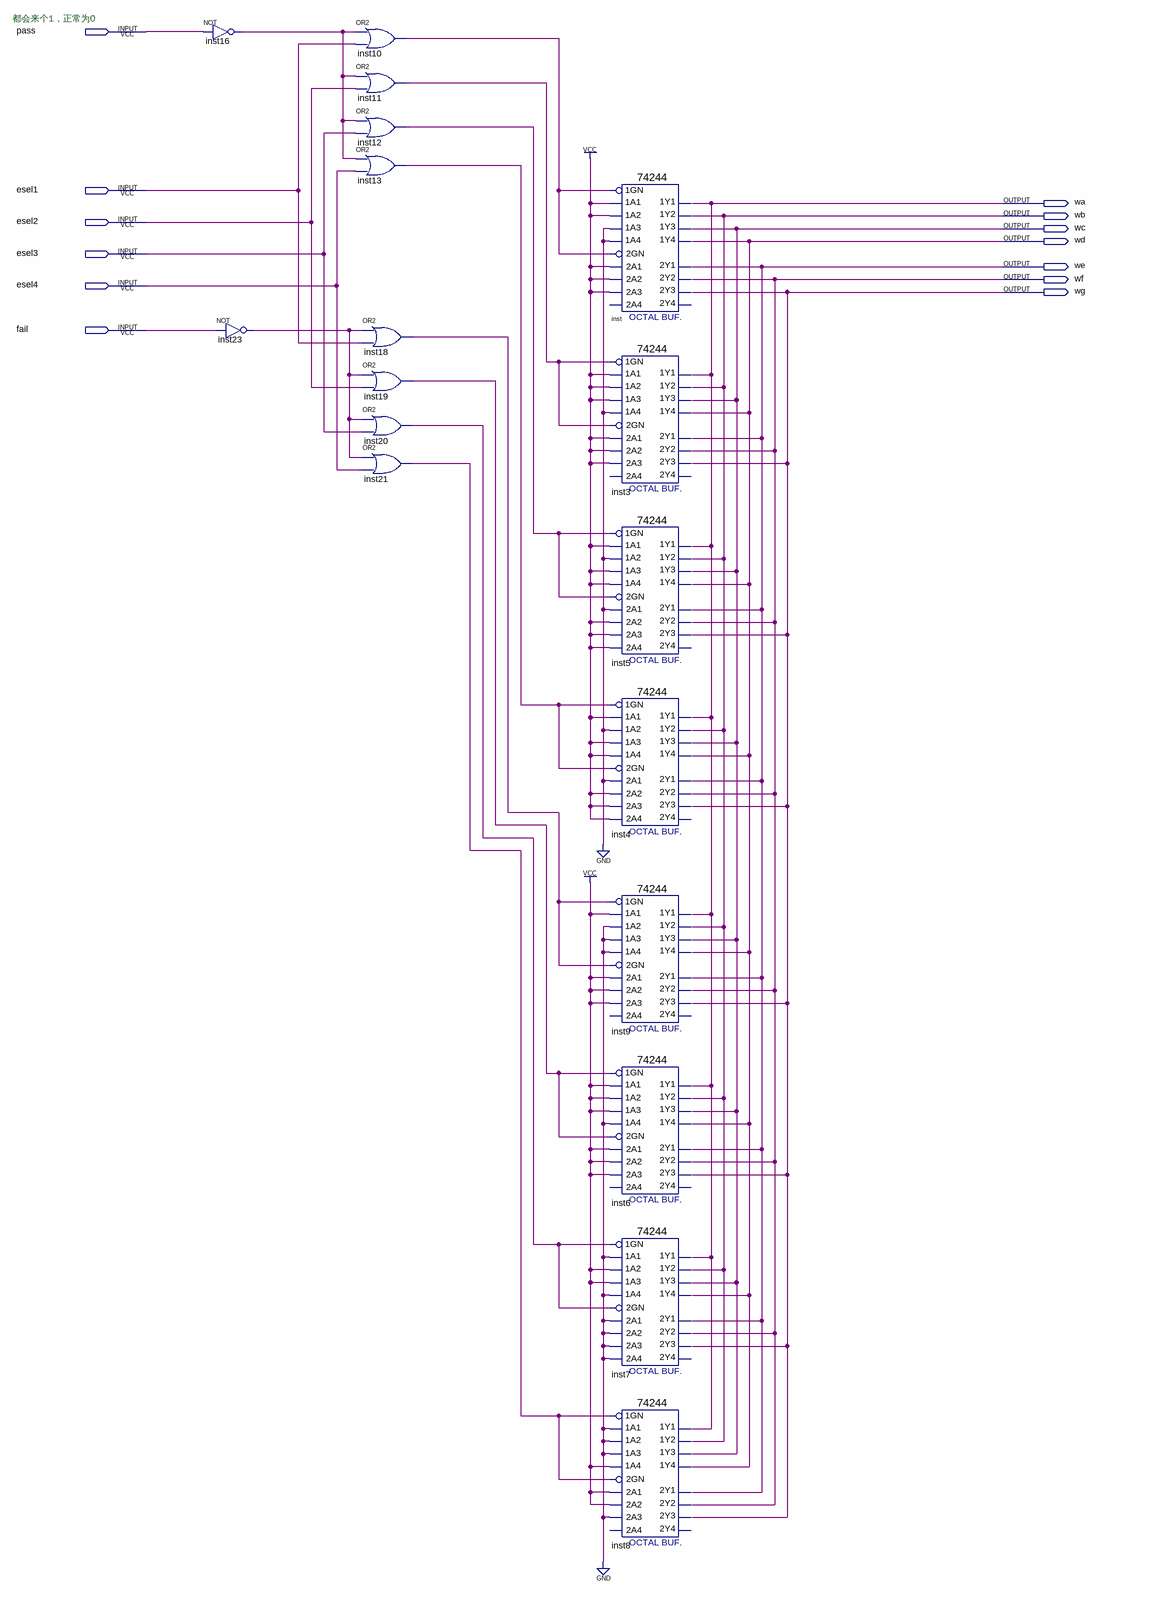
[diagram p0: schematic sheet]
// Quartus schematic wr_pa.bdf as structural Verilog: 18 symbols, 13 pins
module wr_pa (
  input  pass,
  input  esel1,
  input  esel2,
  input  esel3,
  input  esel4,
  input  fail,
  output wa,
  output wb,
  output wc,
  output wd,
  output we,
  output wf,
  output wg
);

  wire inst10_out, inst11_out, inst12_out, inst13_out, inst16_out, inst18_out, inst19_out, inst20_out,
       inst21_out, inst23_out;

  not inst16 (inst16_out, pass);
  not inst23 (inst23_out, fail);
  or inst10 (inst10_out, inst16_out, esel1);
  or inst11 (inst11_out, inst16_out, esel2);
  or inst12 (inst12_out, inst16_out, esel3);
  or inst13 (inst13_out, inst16_out, esel4);
  or inst18 (inst18_out, inst23_out, esel1);
  or inst19 (inst19_out, inst23_out, esel2);
  or inst20 (inst20_out, inst23_out, esel3);
  or inst21 (inst21_out, inst23_out, esel4);
  \74244  inst (
    .\1A2 (1'b1), .\1A4 (1'b0), .\1A1 (1'b1), .\1A3 (1'b0), .\1GN (inst10_out), .\2A3 (1'b1),
    .\2GN (inst10_out), .\2A1 (1'b1), .\2A2 (1'b1), .\1Y2 (wb), .\1Y4 (wd), .\2Y1 (we), .\1Y1 (wa),
    .\2Y3 (wg), .\1Y3 (wc), .\2Y2 (wf));  // open: 2A4, 2Y4
  \74244  inst3 (
    .\1A2 (1'b1), .\1A4 (1'b0), .\1A1 (1'b1), .\1A3 (1'b1), .\1GN (inst11_out), .\2A3 (1'b1),
    .\2GN (inst11_out), .\2A1 (1'b1), .\2A2 (1'b1), .\1Y2 (wb), .\1Y4 (wd), .\2Y1 (we), .\1Y1 (wa),
    .\2Y3 (wg), .\1Y3 (wc), .\2Y2 (wf));  // open: 2A4, 2Y4
  \74244  inst5 (
    .\1A2 (1'b0), .\1A4 (1'b1), .\1A1 (1'b1), .\1A3 (1'b1), .\1GN (inst12_out), .\2A3 (1'b1),
    .\2GN (inst12_out), .\2A1 (1'b0), .\2A4 (1'b1), .\2A2 (1'b1), .\1Y2 (wb), .\1Y4 (wd), .\2Y1 (we),
    .\1Y1 (wa), .\2Y3 (wg), .\1Y3 (wc), .\2Y2 (wf));  // open: 2Y4
  \74244  inst4 (
    .\1A2 (1'b0), .\1A4 (1'b1), .\1A1 (1'b1), .\1A3 (1'b1), .\1GN (inst13_out), .\2A3 (1'b1),
    .\2GN (inst13_out), .\2A1 (1'b0), .\2A4 (1'b1), .\2A2 (1'b1), .\1Y2 (wb), .\1Y4 (wd), .\2Y1 (we),
    .\1Y1 (wa), .\2Y3 (wg), .\1Y3 (wc), .\2Y2 (wf));  // open: 2Y4
  \74244  inst9 (
    .\1A2 (1'b0), .\1A4 (1'b0), .\1A1 (1'b1), .\1A3 (1'b0), .\1GN (inst18_out), .\2A3 (1'b1),
    .\2GN (inst18_out), .\2A1 (1'b1), .\2A2 (1'b1), .\1Y2 (wb), .\1Y4 (wd), .\2Y1 (we), .\1Y1 (wa),
    .\2Y3 (wg), .\1Y3 (wc), .\2Y2 (wf));  // open: 2A4, 2Y4
  \74244  inst6 (
    .\1A2 (1'b1), .\1A4 (1'b0), .\1A1 (1'b1), .\1A3 (1'b1), .\1GN (inst19_out), .\2A3 (1'b1),
    .\2GN (inst19_out), .\2A1 (1'b1), .\2A2 (1'b1), .\1Y2 (wb), .\1Y4 (wd), .\2Y1 (we), .\1Y1 (wa),
    .\2Y3 (wg), .\1Y3 (wc), .\2Y2 (wf));  // open: 2A4, 2Y4
  \74244  inst7 (
    .\1A2 (1'b1), .\1A4 (1'b0), .\1A1 (1'b0), .\1A3 (1'b1), .\1GN (inst20_out), .\2A3 (1'b0),
    .\2GN (inst20_out), .\2A1 (1'b0), .\2A4 (1'b0), .\2A2 (1'b0), .\1Y2 (wb), .\1Y4 (wd), .\2Y1 (we),
    .\1Y1 (wa), .\2Y3 (wg), .\1Y3 (wc), .\2Y2 (wf));  // open: 2Y4
  \74244  inst8 (
    .\1A2 (1'b0), .\1A4 (1'b1), .\1A1 (1'b0), .\1A3 (1'b0), .\1GN (inst21_out), .\2A3 (1'b0),
    .\2GN (inst21_out), .\2A1 (1'b1), .\2A2 (1'b1), .\1Y2 (wb), .\1Y4 (wd), .\2Y1 (we), .\1Y1 (wa),
    .\2Y3 (wg), .\1Y3 (wc), .\2Y2 (wf));  // open: 2A4, 2Y4

  // Notes on the sheet:
  //   都会来个1，正常为0
endmodule
